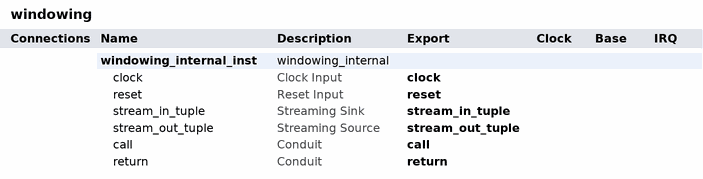
[diagram p0: system contents]
# Platform Designer (Qsys) system windowing, Cyclone V 5CGXFC7C7F23C8
# Parameters at their usual value, and those the tool derives, are not listed.
package require qsys
create_system windowing
set_project_property DEVICE_FAMILY {Cyclone V}
set_project_property DEVICE 5CGXFC7C7F23C8

add_instance windowing_internal_inst windowing_internal 1.0
set_instance_property windowing_internal_inst AUTO_EXPORT true

# exported interfaces
add_interface call conduit end
set_interface_property call EXPORT_OF windowing_internal_inst.call
add_interface clock clock sink
set_interface_property clock EXPORT_OF windowing_internal_inst.clock
add_interface reset reset sink
set_interface_property reset EXPORT_OF windowing_internal_inst.reset
add_interface return conduit end
set_interface_property return EXPORT_OF windowing_internal_inst.return
add_interface stream_in_tuple avalon_streaming sink
set_interface_property stream_in_tuple EXPORT_OF windowing_internal_inst.stream_in_tuple
add_interface stream_out_tuple avalon_streaming source
set_interface_property stream_out_tuple EXPORT_OF windowing_internal_inst.stream_out_tuple

set_interconnect_requirement {$system} qsys_mm.clockCrossingAdapter HANDSHAKE
set_interconnect_requirement {$system} qsys_mm.enableEccProtection FALSE
set_interconnect_requirement {$system} qsys_mm.insertDefaultSlave FALSE
set_interconnect_requirement {$system} qsys_mm.maxAdditionalLatency 1

save_system windowing.qsys
